# EAGLE schematic rx-side (EAGLE 7.4.0)
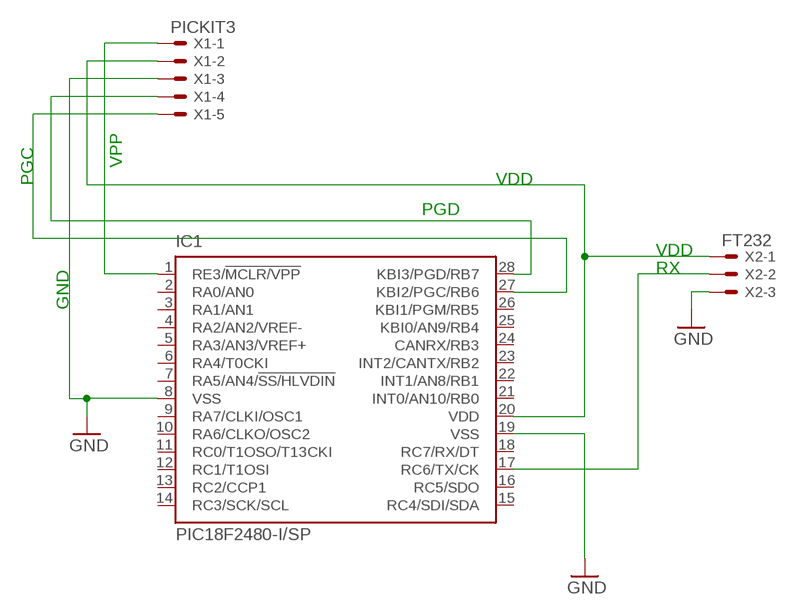
[diagram p0: schematic, sheet 1]

## Parts
IC1  PIC18F2480-I/SP  [DIL28-3]
X1  PICKIT3  22-23-2051  [22-23-2051]
X2  FT232  22-23-2031  [22-23-2031]

## Nets
GND: IC1.8(VSS) IC1.19(VSS) X1.3 X2.3
N$2: IC1.1(RE3/!MCLR/VPP) X1.1
N$3: IC1.20(VDD) X1.2 X2.1
N$4: IC1.28(KBI3/PGD/RB7) X1.4
N$5: IC1.27(KBI2/PGC/RB6) X1.5
N$11: IC1.17(RC6/TX/CK) X2.2
Unconnected: IC1.2(RA0/AN0) IC1.3(RA1/AN1) IC1.4(RA2/AN2/VREF-) IC1.5(RA3/AN3/VREF+) IC1.6(RA4/T0CKI) IC1.7(RA5/AN4/!SS/HLVDIN) IC1.9(RA7/CLKI/OSC1) IC1.10(RA6/CLKO/OSC2) IC1.11(RC0/T1OSO/T13CKI) IC1.12(RC1/T1OSI) IC1.13(RC2/CCP1) IC1.14(RC3/SCK/SCL) IC1.15(RC4/SDI/SDA) IC1.16(RC5/SDO) IC1.18(RC7/RX/DT) IC1.21(INT0/AN10/RB0) IC1.22(INT1/AN8/RB1) IC1.23(INT2/CANTX/RB2) IC1.24(CANRX/RB3) IC1.25(KBI0/AN9/RB4) IC1.26(KBI1/PGM/RB5)

## Notes on the sheet
- VPP
- PGC | VDD
- PGD
- VDD
- RX
- GND

## Library data of the parts
IC1 = microchip:PIC18F2*80: 28-Pin Enhanced Flash Microcontrollers with ECAN(TM) Technology 10-Bit A/D and nanoWatt Technology Source: http://www.microchip.com .. 39637a.pdf; MF: MICROCHIP; MPN: PIC18F2480-I/SP; OC_FARNELL: 9321217; OC_NEWARK: 71J7237
X1 = con-molex:22-23-2051: .100" (2.54mm) Center Header - 5 Pin; MF: MOLEX; MPN: 22-23-2051; OC_FARNELL: 1462952; OC_NEWARK: 38C9178
X2 = con-molex:22-23-2031: .100" (2.54mm) Center Header - 3 Pin; MF: MOLEX; MPN: 22-23-2031; OC_FARNELL: 1462950; OC_NEWARK: 30C0862